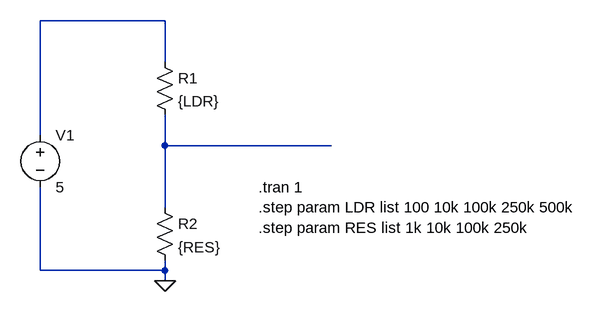
[diagram p0: schematic ldr-circuit.asc]
ldr-circuit.asc, the LTspice schematic file:
Version 4
SHEET 1 1452 680
WIRE 800 -192 608 -192
WIRE 800 -128 800 -192
WIRE 608 -16 608 -192
WIRE 800 0 800 -48
WIRE 1056 0 800 0
WIRE 800 96 800 0
WIRE 608 192 608 64
WIRE 800 192 800 176
WIRE 800 192 608 192
WIRE 800 208 800 192
FLAG 800 208 0
SYMBOL Res 784 -144 R0
SYMATTR InstName R1
SYMATTR Value {LDR}
SYMBOL Res 784 80 R0
SYMATTR InstName R2
SYMATTR Value {RES}
SYMBOL voltage 608 -32 R0
SYMATTR InstName V1
SYMATTR Value 5
TEXT 944 64 Left 2 !.tran 1\n.step param LDR list 100 10k 100k 250k 500k\n.step param RES list 1k 10k 100k 250k

The netlist it stands for:
* ldr-circuit.asc
R1 N001 N002 {LDR}
R2 N002 0 {RES}
V1 N001 0 5
.tran 1
.step param LDR list 100 10k 100k 250k 500k
.step param RES list 1k 10k 100k 250k
.backanno
.end